# Altium schematic sheet Chain.SchDoc
size A0
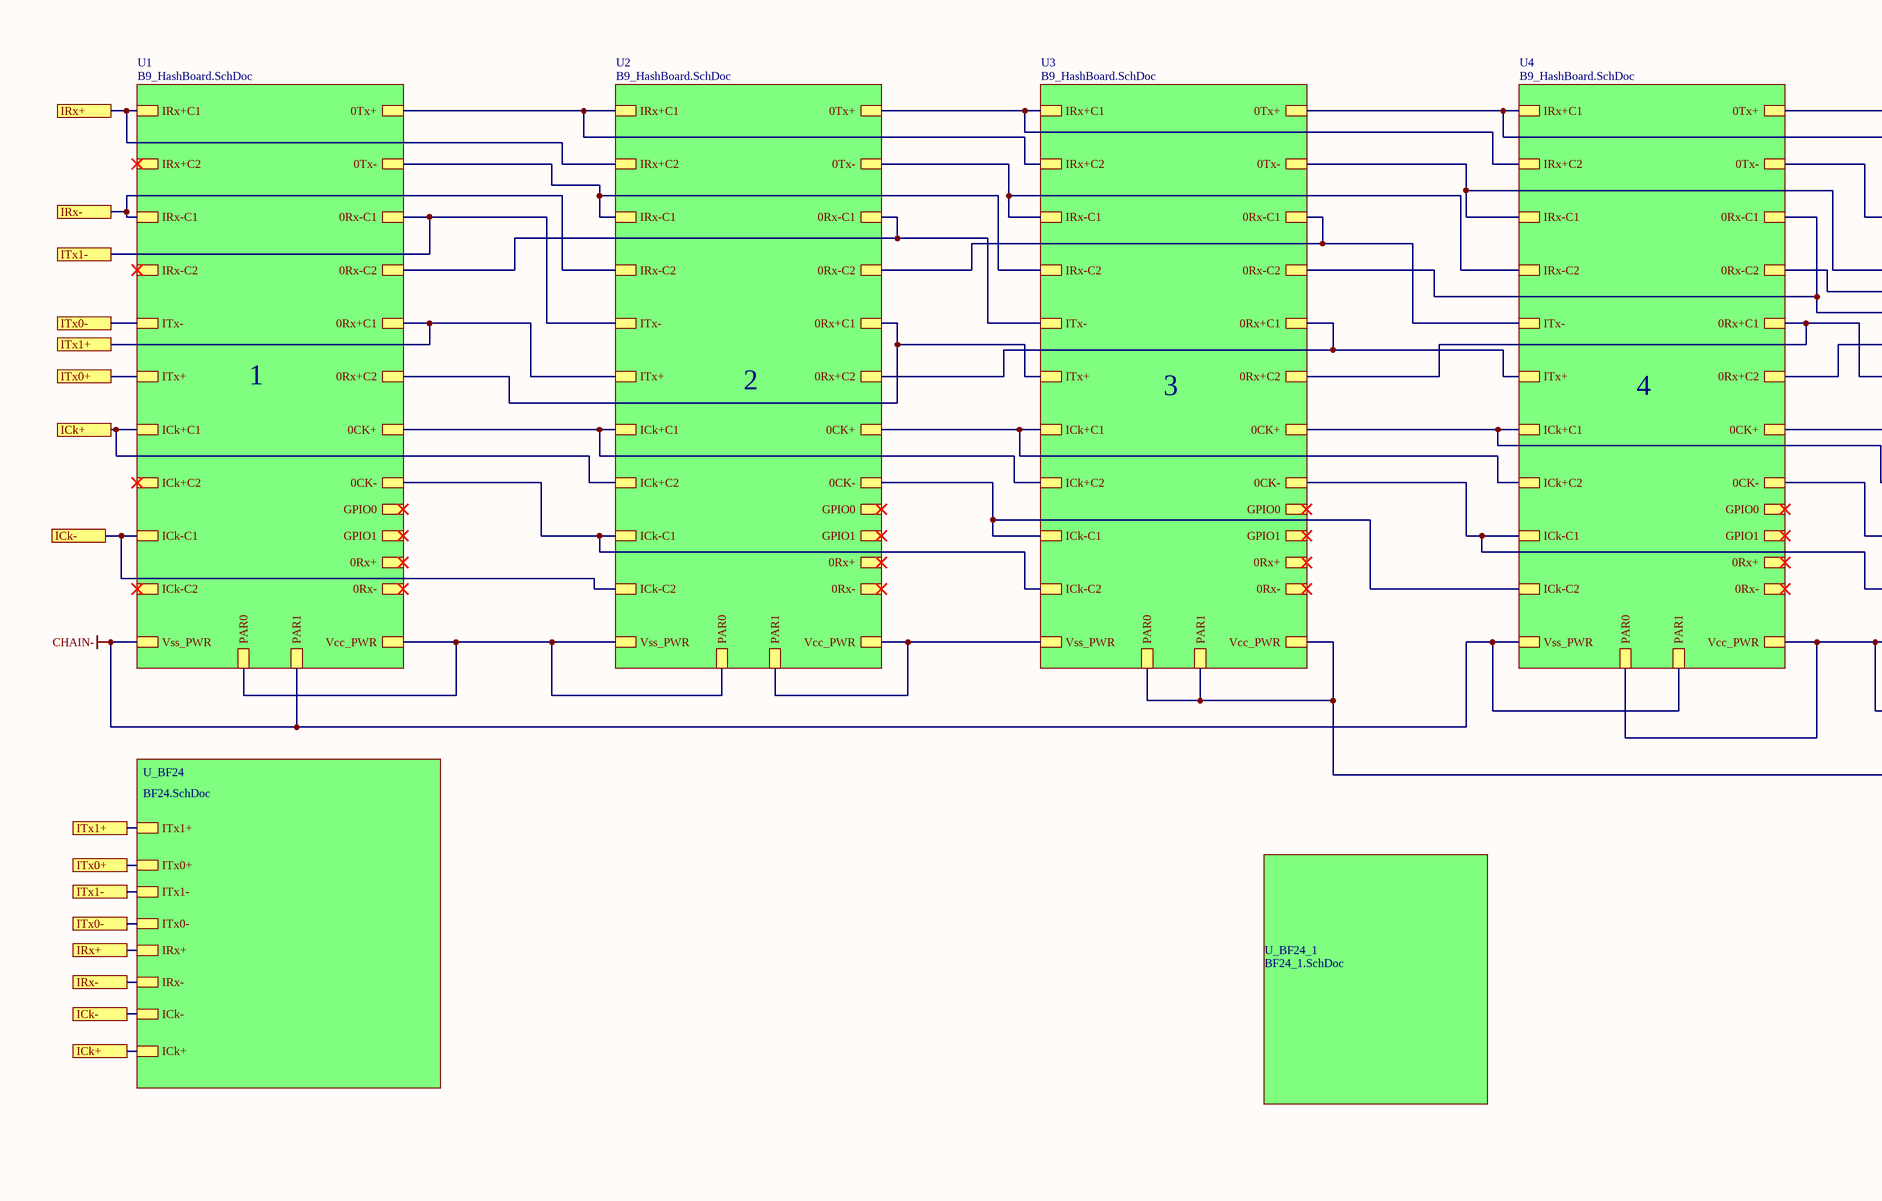
[diagram p0: Chain.SchDoc, top left]
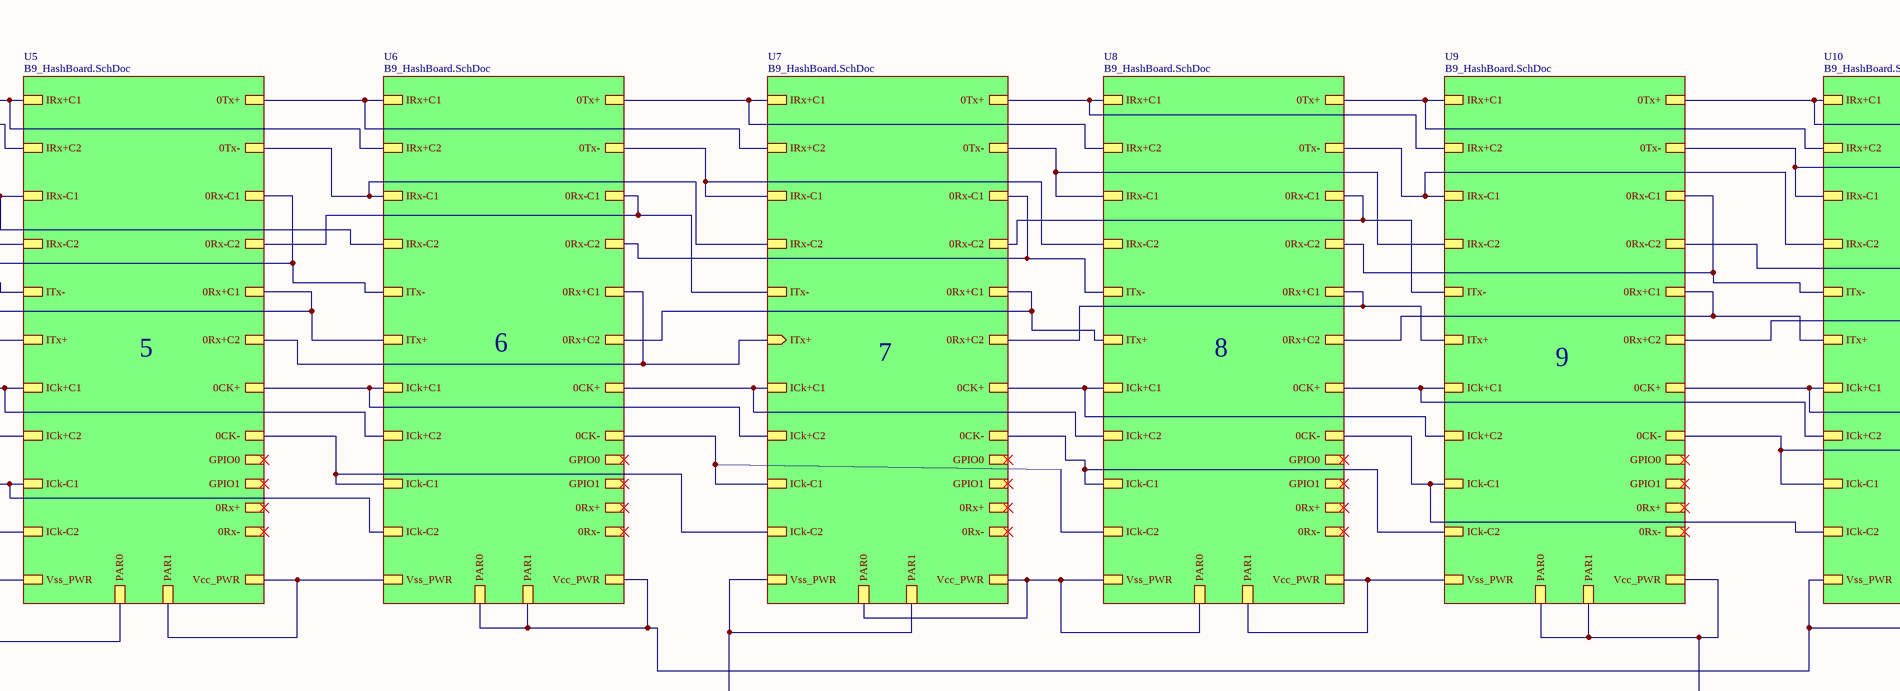
[diagram p1: Chain.SchDoc, top middle]
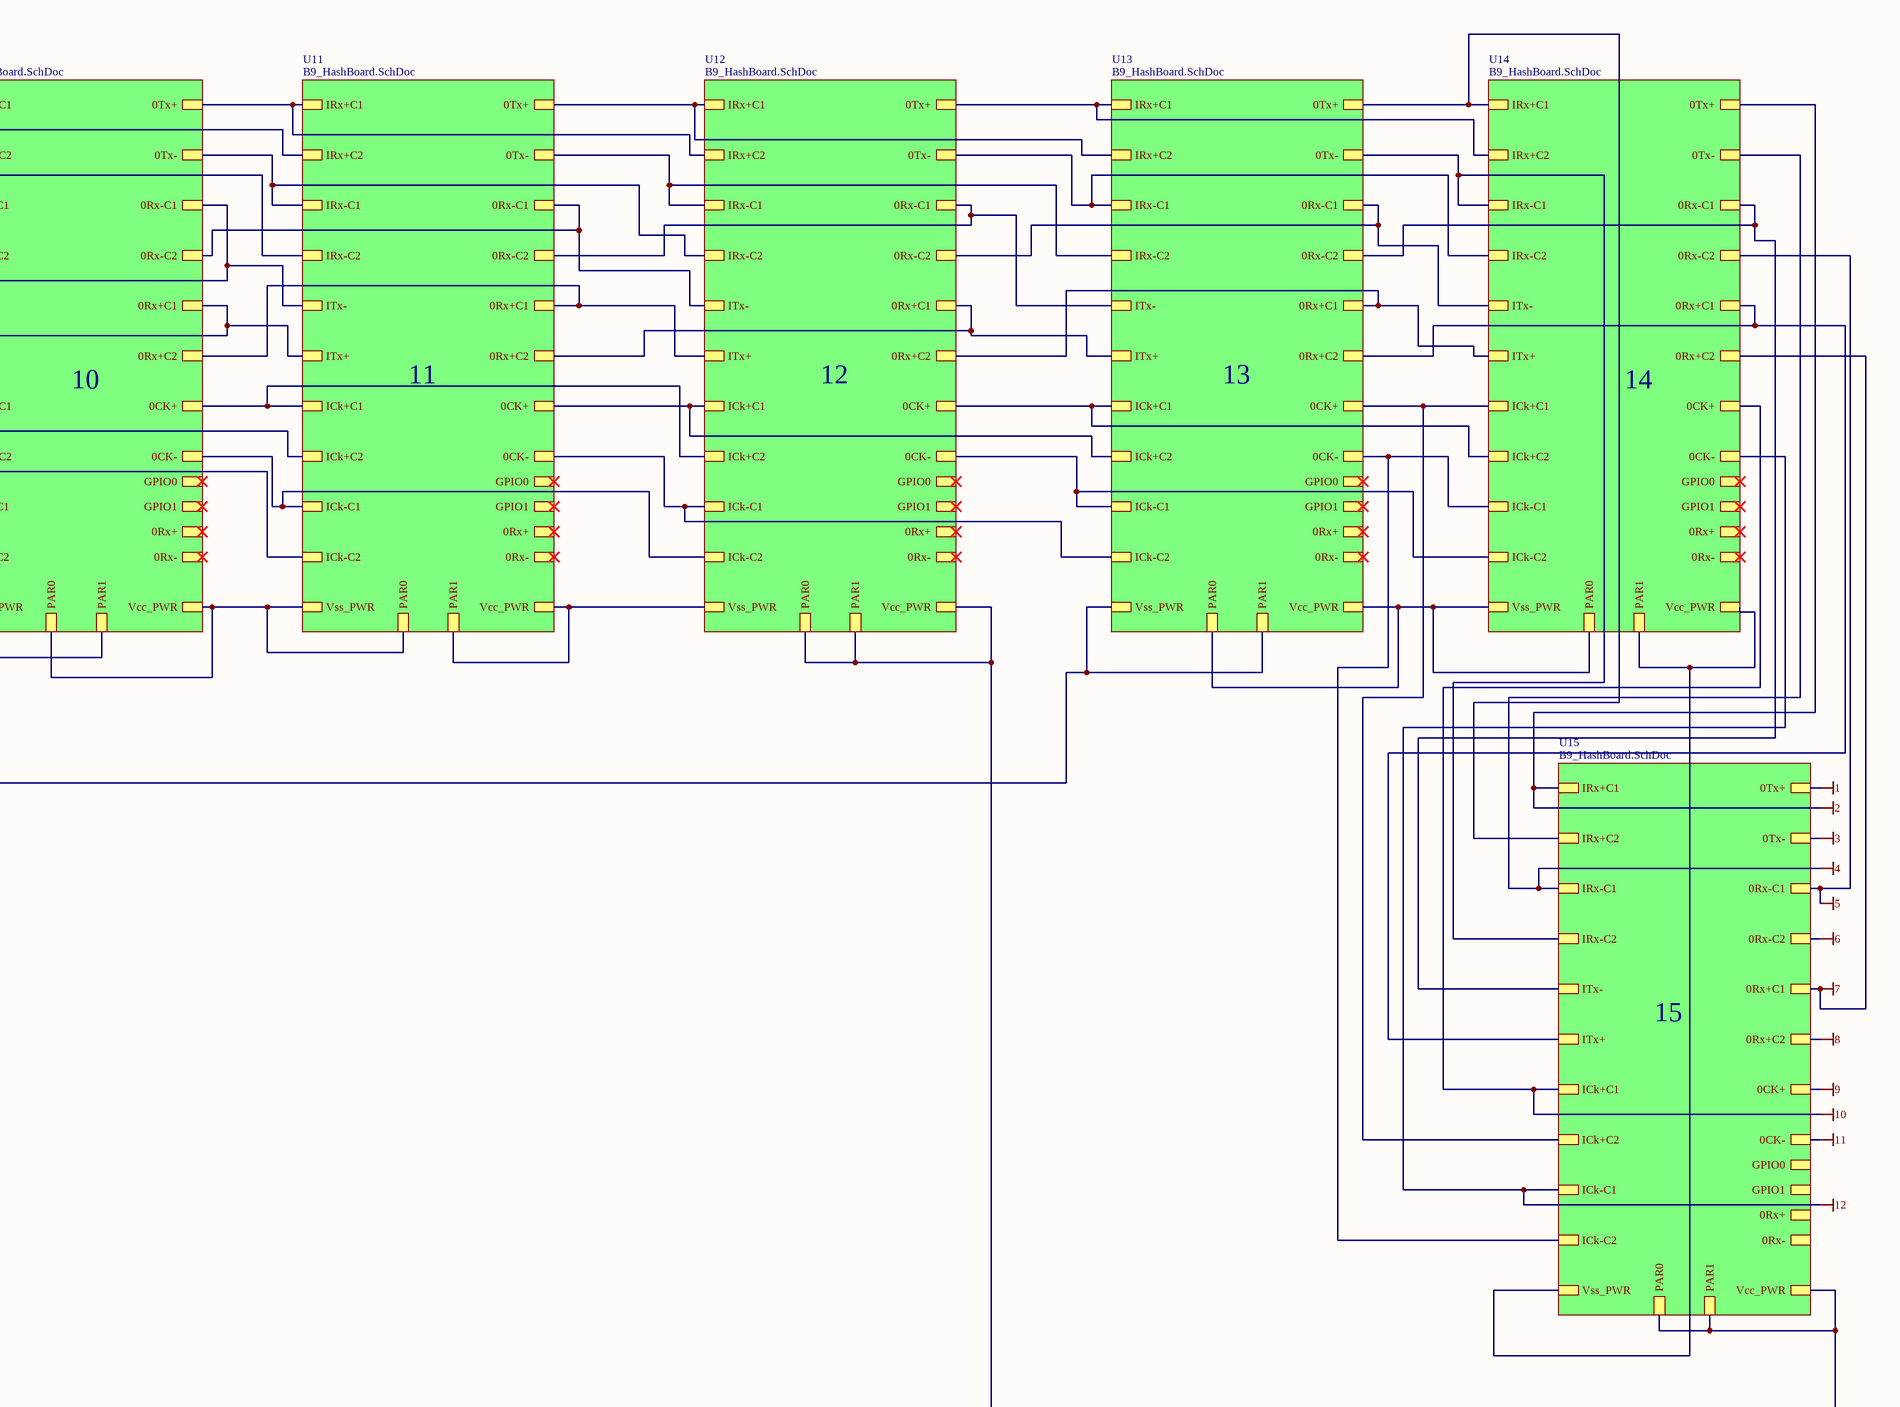
[diagram p2: Chain.SchDoc, top right]
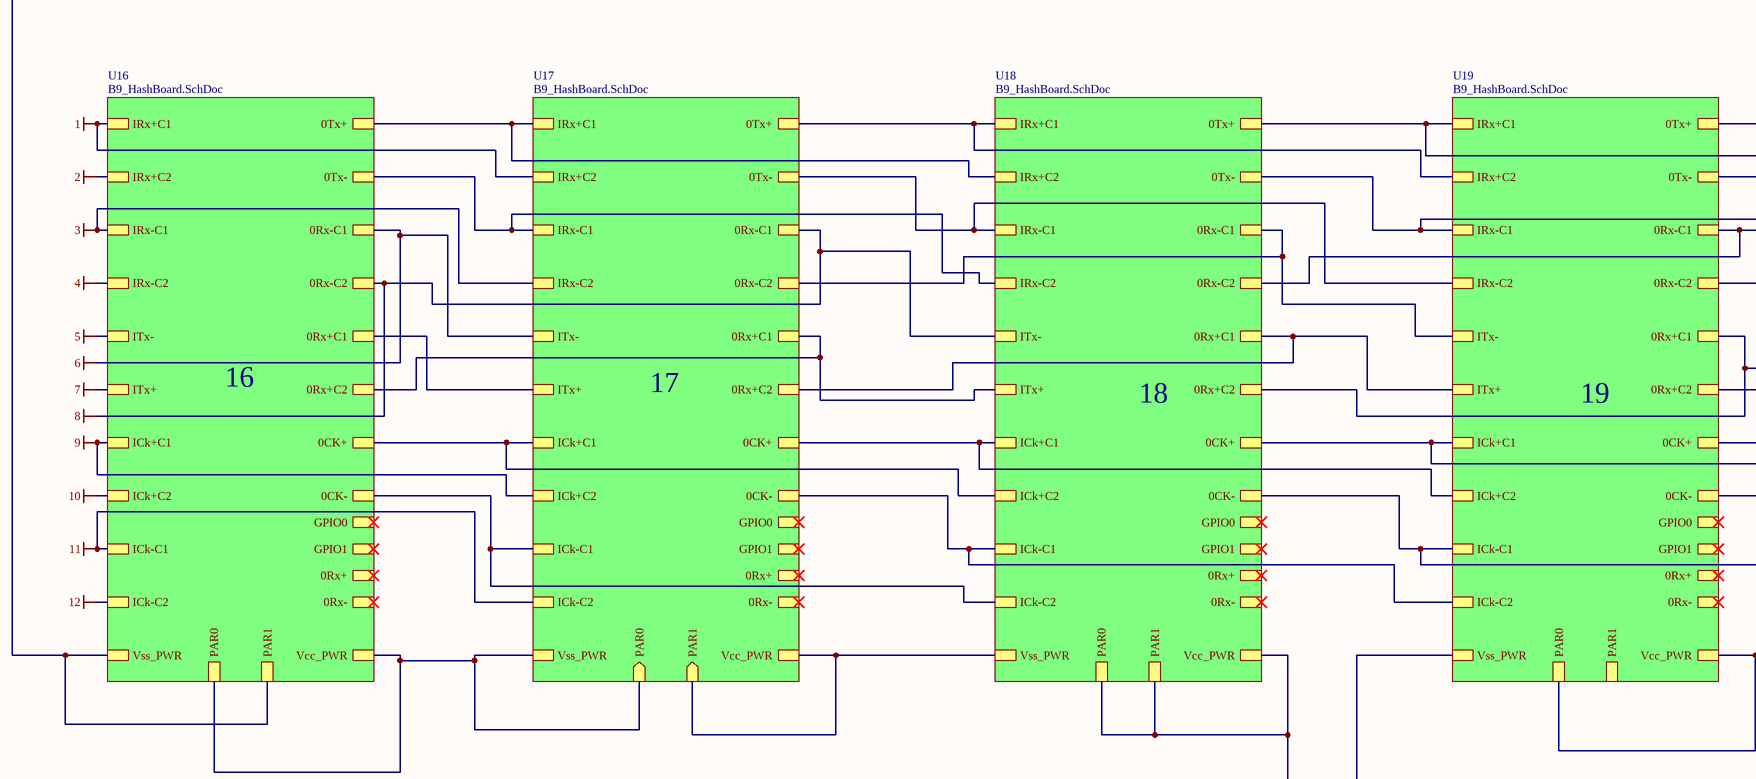
[diagram p3: Chain.SchDoc, bottom left]
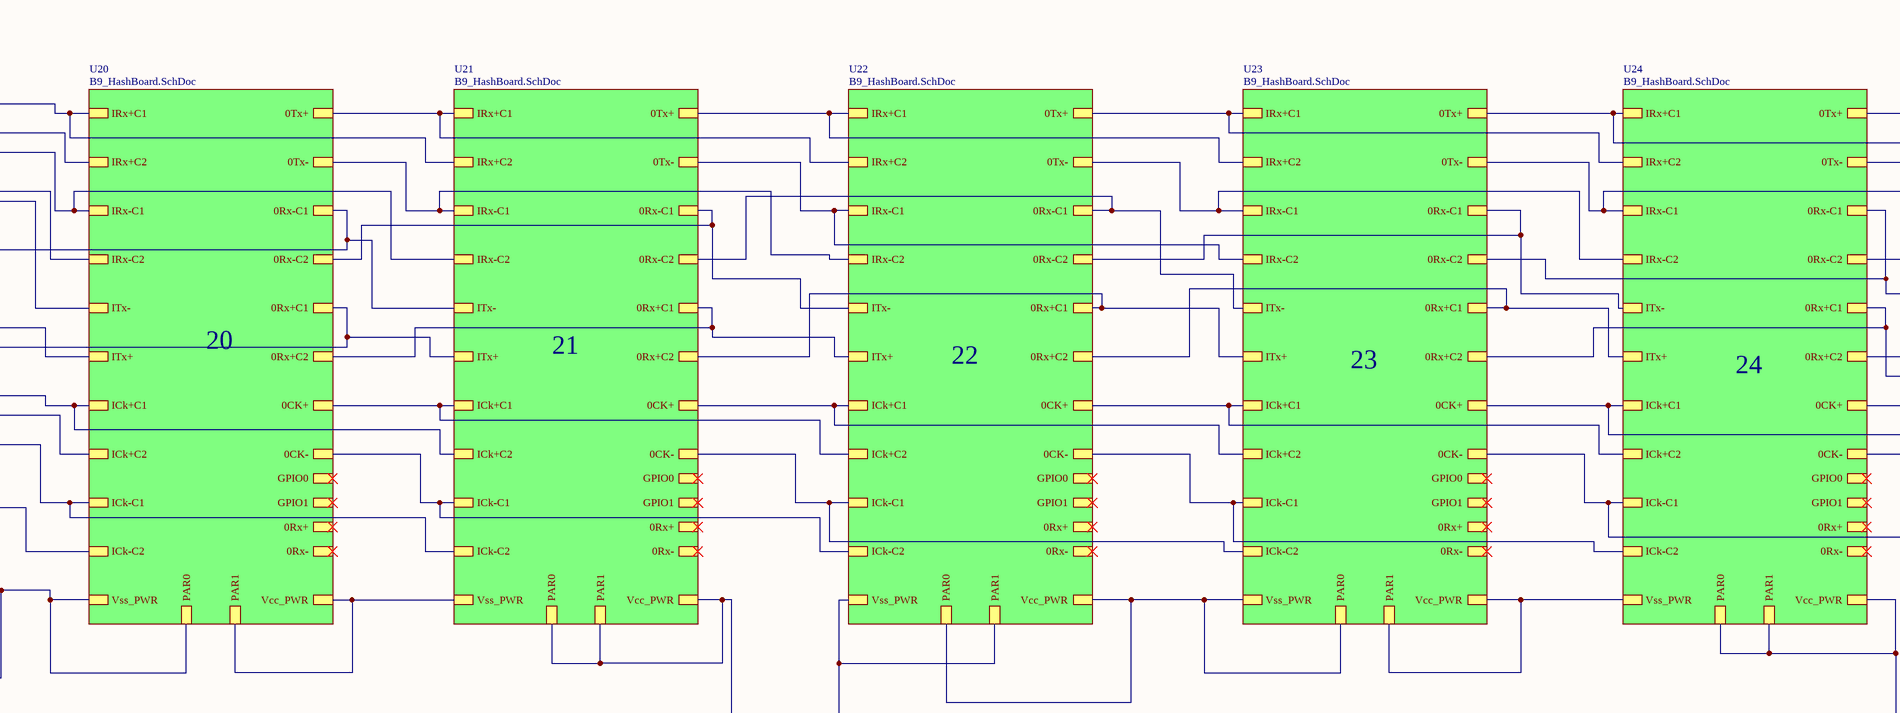
[diagram p4: Chain.SchDoc, bottom middle]
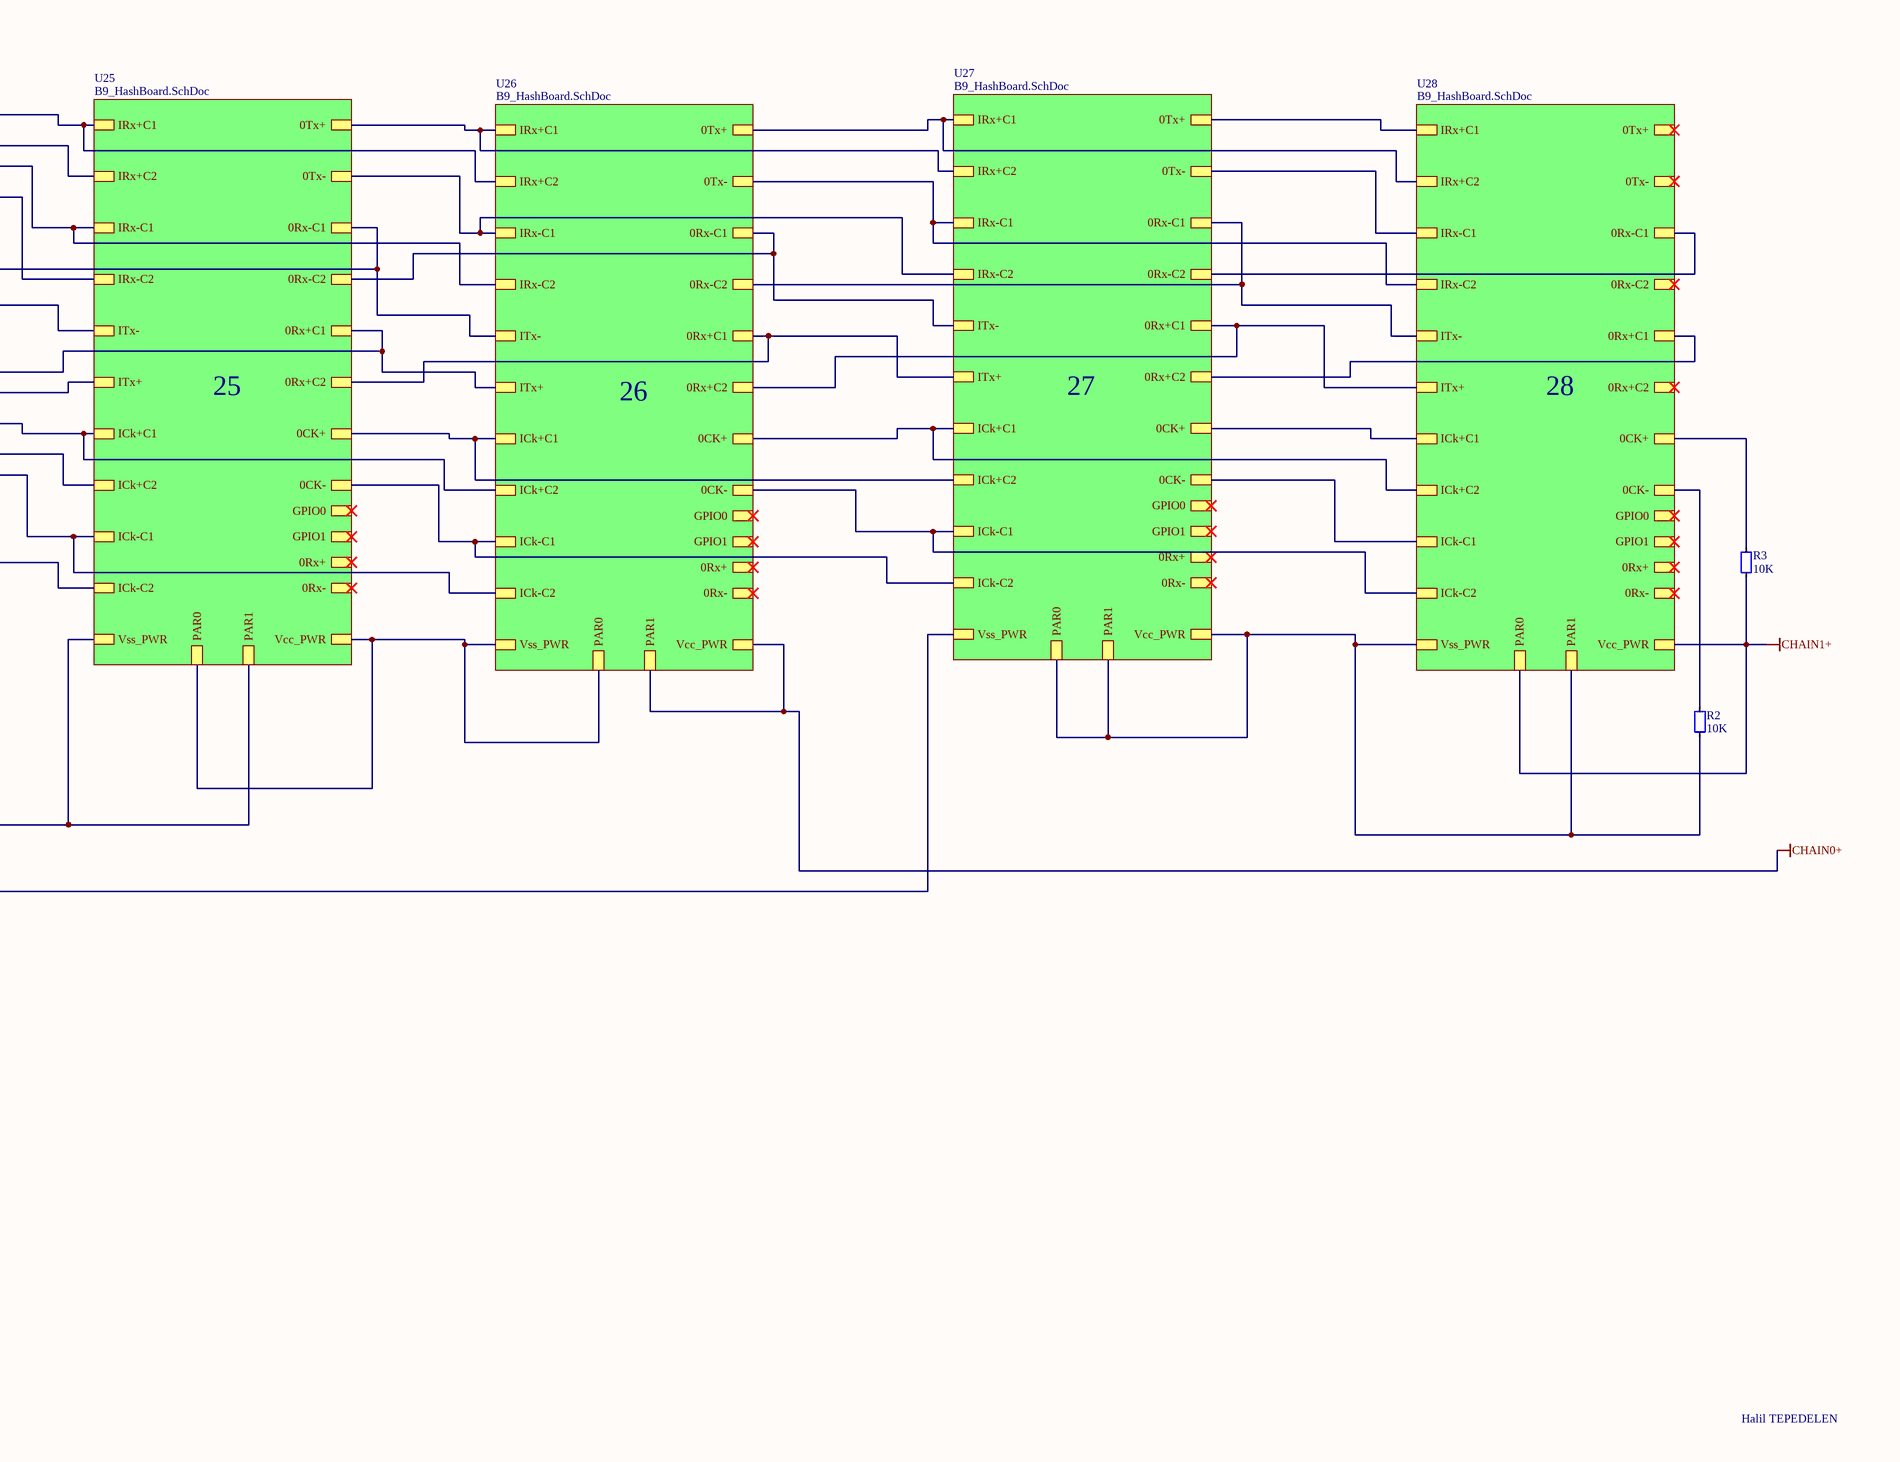
[diagram p5: Chain.SchDoc, bottom right]

## Parts
R2  10K  [R-0402R]
R3  10K  [R-0402R]

## Sub-sheets
U1 = B9_HashBoard.SchDoc: Vcc_PWR, Vss_PWR, 0Rx+, 0Rx-, 0Rx+C1, 0Rx-C1, 0Rx+C2, 0Rx-C2, 0Tx+, 0Tx-, 0CK+, 0CK-, ICk-C1, ICk+C1, IRx-C1, IRx+C1, ITx-, ITx+, IRx-C2, IRx+C2, ICk-C2, ICk+C2, PAR0, PAR1, GPIO0, GPIO1
U2 = B9_HashBoard.SchDoc: Vcc_PWR, Vss_PWR, 0Rx+, 0Rx-, 0Rx+C1, 0Rx-C1, 0Rx+C2, 0Rx-C2, 0Tx+, 0Tx-, 0CK+, 0CK-, ICk-C1, ICk+C1, IRx-C1, IRx+C1, ITx-, ITx+, IRx-C2, IRx+C2, ICk-C2, ICk+C2, PAR0, PAR1, GPIO0, GPIO1
U3 = B9_HashBoard.SchDoc: Vcc_PWR, Vss_PWR, 0Rx+, 0Rx-, 0Rx+C1, 0Rx-C1, 0Rx+C2, 0Rx-C2, 0Tx+, 0Tx-, 0CK+, 0CK-, ICk-C1, ICk+C1, IRx-C1, IRx+C1, ITx-, ITx+, IRx-C2, IRx+C2, ICk-C2, ICk+C2, PAR0, PAR1, GPIO0, GPIO1
U4 = B9_HashBoard.SchDoc: Vcc_PWR, Vss_PWR, 0Rx+, 0Rx-, 0Rx+C1, 0Rx-C1, 0Rx+C2, 0Rx-C2, 0Tx+, 0Tx-, 0CK+, 0CK-, ICk-C1, ICk+C1, IRx-C1, IRx+C1, ITx-, ITx+, IRx-C2, IRx+C2, ICk-C2, ICk+C2, PAR0, PAR1, GPIO0, GPIO1
U5 = B9_HashBoard.SchDoc: Vcc_PWR, Vss_PWR, 0Rx+, 0Rx-, 0Rx+C1, 0Rx-C1, 0Rx+C2, 0Rx-C2, 0Tx+, 0Tx-, 0CK+, 0CK-, ICk-C1, ICk+C1, IRx-C1, IRx+C1, ITx-, ITx+, IRx-C2, IRx+C2, ICk-C2, ICk+C2, PAR0, PAR1, GPIO0, GPIO1
U6 = B9_HashBoard.SchDoc: Vcc_PWR, Vss_PWR, 0Rx+, 0Rx-, 0Rx+C1, 0Rx-C1, 0Rx+C2, 0Rx-C2, 0Tx+, 0Tx-, 0CK+, 0CK-, ICk-C1, ICk+C1, IRx-C1, IRx+C1, ITx-, ITx+, IRx-C2, IRx+C2, ICk-C2, ICk+C2, PAR0, PAR1, GPIO0, GPIO1
U7 = B9_HashBoard.SchDoc: Vcc_PWR, Vss_PWR, 0Rx+, 0Rx-, 0Rx+C1, 0Rx-C1, 0Rx+C2, 0Rx-C2, 0Tx+, 0Tx-, 0CK+, 0CK-, ICk-C1, ICk+C1, IRx-C1, IRx+C1, ITx-, ITx+ (in), IRx-C2, IRx+C2, ICk-C2, ICk+C2, PAR0, PAR1, GPIO0, GPIO1
U8 = B9_HashBoard.SchDoc: Vcc_PWR, Vss_PWR, 0Rx+, 0Rx-, 0Rx+C1, 0Rx-C1, 0Rx+C2, 0Rx-C2, 0Tx+, 0Tx-, 0CK+, 0CK-, ICk-C1, ICk+C1, IRx-C1, IRx+C1, ITx-, ITx+, IRx-C2, IRx+C2, ICk-C2, ICk+C2, PAR0, PAR1, GPIO0, GPIO1
U9 = B9_HashBoard.SchDoc: Vcc_PWR, Vss_PWR, 0Rx+, 0Rx-, 0Rx+C1, 0Rx-C1, 0Rx+C2, 0Rx-C2, 0Tx+, 0Tx-, 0CK+, 0CK-, ICk-C1, ICk+C1, IRx-C1, IRx+C1, ITx-, ITx+, IRx-C2, IRx+C2, ICk-C2, ICk+C2, PAR0, PAR1, GPIO0, GPIO1
U10 = B9_HashBoard.SchDoc: Vcc_PWR, Vss_PWR, 0Rx+, 0Rx-, 0Rx+C1, 0Rx-C1, 0Rx+C2, 0Rx-C2, 0Tx+, 0Tx-, 0CK+, 0CK-, ICk-C1, ICk+C1, IRx-C1, IRx+C1, ITx-, ITx+, IRx-C2, IRx+C2, ICk-C2, ICk+C2, PAR0, PAR1, GPIO0, GPIO1
U11 = B9_HashBoard.SchDoc: Vcc_PWR, Vss_PWR, 0Rx+, 0Rx-, 0Rx+C1, 0Rx-C1, 0Rx+C2, 0Rx-C2, 0Tx+, 0Tx-, 0CK+, 0CK-, ICk-C1, ICk+C1, IRx-C1, IRx+C1, ITx-, ITx+, IRx-C2, IRx+C2, ICk-C2, ICk+C2, PAR0, PAR1, GPIO0, GPIO1
U12 = B9_HashBoard.SchDoc: Vcc_PWR, Vss_PWR, 0Rx+, 0Rx-, 0Rx+C1, 0Rx-C1, 0Rx+C2, 0Rx-C2, 0Tx+, 0Tx-, 0CK+, 0CK-, ICk-C1, ICk+C1, IRx-C1, IRx+C1, ITx-, ITx+, IRx-C2, IRx+C2, ICk-C2, ICk+C2, PAR0, PAR1, GPIO0, GPIO1
U13 = B9_HashBoard.SchDoc: Vcc_PWR, Vss_PWR, 0Rx+, 0Rx-, 0Rx+C1, 0Rx-C1, 0Rx+C2, 0Rx-C2, 0Tx+, 0Tx-, 0CK+, 0CK-, ICk-C1, ICk+C1, IRx-C1, IRx+C1, ITx-, ITx+, IRx-C2, IRx+C2, ICk-C2, ICk+C2, PAR0, PAR1, GPIO0, GPIO1
U14 = B9_HashBoard.SchDoc: Vcc_PWR, Vss_PWR, 0Rx+, 0Rx-, 0Rx+C1, 0Rx-C1, 0Rx+C2, 0Rx-C2, 0Tx+, 0Tx-, 0CK+, 0CK-, ICk-C1, ICk+C1, IRx-C1, IRx+C1, ITx-, ITx+, IRx-C2, IRx+C2, ICk-C2, ICk+C2, PAR0, PAR1, GPIO0, GPIO1
U15 = B9_HashBoard.SchDoc: Vcc_PWR, Vss_PWR, 0Rx+, 0Rx-, 0Rx+C1, 0Rx-C1, 0Rx+C2, 0Rx-C2, 0Tx+, 0Tx-, 0CK+, 0CK-, ICk-C1, ICk+C1, IRx-C1, IRx+C1, ITx-, ITx+, IRx-C2, IRx+C2, ICk-C2, ICk+C2, PAR0, PAR1, GPIO0, GPIO1
U16 = B9_HashBoard.SchDoc: Vcc_PWR, Vss_PWR, 0Rx+, 0Rx-, 0Rx+C1, 0Rx-C1, 0Rx+C2, 0Rx-C2, 0Tx+, 0Tx-, 0CK+, 0CK-, ICk-C1, ICk+C1, IRx-C1, IRx+C1, ITx-, ITx+, IRx-C2, IRx+C2, ICk-C2, ICk+C2, PAR0, PAR1, GPIO0, GPIO1
U17 = B9_HashBoard.SchDoc: Vcc_PWR, Vss_PWR, 0Rx+, 0Rx-, 0Rx+C1, 0Rx-C1, 0Rx+C2, 0Rx-C2, 0Tx+, 0Tx-, 0CK+, 0CK-, ICk-C1, ICk+C1, IRx-C1, IRx+C1, ITx-, ITx+, IRx-C2, IRx+C2, ICk-C2, ICk+C2, PAR0 (in), PAR1 (in), GPIO0, GPIO1
U18 = B9_HashBoard.SchDoc: Vcc_PWR, Vss_PWR, 0Rx+, 0Rx-, 0Rx+C1, 0Rx-C1, 0Rx+C2, 0Rx-C2, 0Tx+, 0Tx-, 0CK+, 0CK-, ICk-C1, ICk+C1, IRx-C1, IRx+C1, ITx-, ITx+, IRx-C2, IRx+C2, ICk-C2, ICk+C2, PAR0, PAR1, GPIO0, GPIO1
U19 = B9_HashBoard.SchDoc: Vcc_PWR, Vss_PWR, 0Rx+, 0Rx-, 0Rx+C1, 0Rx-C1, 0Rx+C2, 0Rx-C2, 0Tx+, 0Tx-, 0CK+, 0CK-, ICk-C1, ICk+C1, IRx-C1, IRx+C1, ITx-, ITx+, IRx-C2, IRx+C2, ICk-C2, ICk+C2, PAR0, PAR1, GPIO0, GPIO1
U20 = B9_HashBoard.SchDoc: Vcc_PWR, Vss_PWR, 0Rx+, 0Rx-, 0Rx+C1, 0Rx-C1, 0Rx+C2, 0Rx-C2, 0Tx+, 0Tx-, 0CK+, 0CK-, ICk-C1, ICk+C1, IRx-C1, IRx+C1, ITx-, ITx+, IRx-C2, IRx+C2, ICk-C2, ICk+C2, PAR0, PAR1, GPIO0, GPIO1
U21 = B9_HashBoard.SchDoc: Vcc_PWR, Vss_PWR, 0Rx+, 0Rx-, 0Rx+C1, 0Rx-C1, 0Rx+C2, 0Rx-C2, 0Tx+, 0Tx-, 0CK+, 0CK-, ICk-C1, ICk+C1, IRx-C1, IRx+C1, ITx-, ITx+, IRx-C2, IRx+C2, ICk-C2, ICk+C2, PAR0, PAR1, GPIO0, GPIO1
U22 = B9_HashBoard.SchDoc: Vcc_PWR, Vss_PWR, 0Rx+, 0Rx-, 0Rx+C1, 0Rx-C1, 0Rx+C2, 0Rx-C2, 0Tx+, 0Tx-, 0CK+, 0CK-, ICk-C1, ICk+C1, IRx-C1, IRx+C1, ITx-, ITx+, IRx-C2, IRx+C2, ICk-C2, ICk+C2, PAR0, PAR1, GPIO0, GPIO1
U23 = B9_HashBoard.SchDoc: Vcc_PWR, Vss_PWR, 0Rx+, 0Rx-, 0Rx+C1, 0Rx-C1, 0Rx+C2, 0Rx-C2, 0Tx+, 0Tx-, 0CK+, 0CK-, ICk-C1, ICk+C1, IRx-C1, IRx+C1, ITx-, ITx+, IRx-C2, IRx+C2, ICk-C2, ICk+C2, PAR0, PAR1, GPIO0, GPIO1
U24 = B9_HashBoard.SchDoc: Vcc_PWR, Vss_PWR, 0Rx+, 0Rx-, 0Rx+C1, 0Rx-C1, 0Rx+C2, 0Rx-C2, 0Tx+, 0Tx-, 0CK+, 0CK-, ICk-C1, ICk+C1, IRx-C1, IRx+C1, ITx-, ITx+, IRx-C2, IRx+C2, ICk-C2, ICk+C2, PAR0, PAR1, GPIO0, GPIO1
U25 = B9_HashBoard.SchDoc: Vcc_PWR, Vss_PWR, 0Rx+, 0Rx-, 0Rx+C1, 0Rx-C1, 0Rx+C2, 0Rx-C2, 0Tx+, 0Tx-, 0CK+, 0CK-, ICk-C1, ICk+C1, IRx-C1, IRx+C1, ITx-, ITx+, IRx-C2, IRx+C2, ICk-C2, ICk+C2, PAR0, PAR1, GPIO0, GPIO1
U26 = B9_HashBoard.SchDoc: Vcc_PWR, Vss_PWR, 0Rx+, 0Rx-, 0Rx+C1, 0Rx-C1, 0Rx+C2, 0Rx-C2, 0Tx+, 0Tx-, 0CK+, 0CK-, ICk-C1, ICk+C1, IRx-C1, IRx+C1, ITx-, ITx+, IRx-C2, IRx+C2, ICk-C2, ICk+C2, PAR0, PAR1, GPIO0, GPIO1
U27 = B9_HashBoard.SchDoc: Vcc_PWR, Vss_PWR, 0Rx+, 0Rx-, 0Rx+C1, 0Rx-C1, 0Rx+C2, 0Rx-C2, 0Tx+, 0Tx-, 0CK+, 0CK-, ICk-C1, ICk+C1, IRx-C1, IRx+C1, ITx-, ITx+, IRx-C2, IRx+C2, ICk-C2, ICk+C2, PAR0, PAR1, GPIO0, GPIO1
U28 = B9_HashBoard.SchDoc: Vcc_PWR, Vss_PWR, 0Rx+, 0Rx-, 0Rx+C1, 0Rx-C1, 0Rx+C2, 0Rx-C2, 0Tx+, 0Tx-, 0CK+, 0CK-, ICk-C1, ICk+C1, IRx-C1, IRx+C1, ITx-, ITx+, IRx-C2, IRx+C2, ICk-C2, ICk+C2, PAR0, PAR1, GPIO0, GPIO1
U_BF24 = BF24.SchDoc: ITx1+, ITx0+, ITx1-, ITx0-, IRx+, IRx-, ICk-, ICk+
U_BF24_1 = BF24_1.SchDoc: no entries

## Ports
ICk+, ICk-, IRx+, IRx-, ITx0+, ITx0-, ITx1+, ITx1-

## Nets
1: sheet U15/0Tx+, sheet U16/IRx+C1, sheet U17/IRx+C2
2: sheet U14/0Tx+, sheet U15/IRx+C1, sheet U16/IRx+C2
3: sheet U15/0Tx-, sheet U16/IRx-C1, sheet U17/IRx-C2
4: sheet U14/0Tx-, sheet U15/IRx-C1, sheet U16/IRx-C2
5: sheet U14/0Rx-C2, sheet U15/0Rx-C1, sheet U16/ITx-
6: sheet U15/0Rx-C2, sheet U16/0Rx-C1, sheet U17/ITx-
7: sheet U14/0Rx+C2, sheet U15/0Rx+C1, sheet U16/ITx+
8: sheet U15/0Rx+C2, sheet U16/0Rx-C2, sheet U17/0Rx-C1, sheet U18/ITx-
9: sheet U15/0CK+, sheet U16/ICk+C1, sheet U17/ICk+C2
10: sheet U14/0CK+, sheet U15/ICk+C1, sheet U16/ICk+C2
11: sheet U15/0CK-, sheet U16/ICk-C1, sheet U17/ICk-C2
12: sheet U14/0CK-, sheet U15/ICk-C1, sheet U16/ICk-C2
CHAIN0+: sheet U26/Vcc_PWR, sheet U26/PAR1
CHAIN1+: R3.1 ; sheet U28/Vcc_PWR, sheet U28/PAR0
CHAIN-: sheet U1/Vss_PWR, sheet U1/PAR1, sheet U4/Vss_PWR, sheet U4/PAR1
ICk+: port ICk+, sheet U1/ICk+C1, sheet U2/ICk+C2, sheet U_BF24/ICk+
ICk-: port ICk-, sheet U1/ICk-C1, sheet U2/ICk-C2, sheet U_BF24/ICk-
IRx+: port IRx+, sheet U1/IRx+C1, sheet U2/IRx+C2, sheet U_BF24/IRx+
IRx-: port IRx-, sheet U1/IRx-C1, sheet U2/IRx-C2, sheet U_BF24/IRx-
ITx0+: port ITx0+, sheet U1/ITx+, sheet U_BF24/ITx0+
ITx0-: port ITx0-, sheet U1/ITx-, sheet U_BF24/ITx0-
ITx1+: port ITx1+, sheet U1/0Rx+C1, sheet U2/ITx+, sheet U_BF24/ITx1+
ITx1-: port ITx1-, sheet U1/0Rx-C1, sheet U2/ITx-, sheet U_BF24/ITx1-
NetR2_1: R2.1 ; sheet U27/Vcc_PWR, sheet U27/PAR0, sheet U27/PAR1, sheet U28/Vss_PWR, sheet U28/PAR1
NetR2_2: R2.2 ; sheet U28/0CK-
NetR3_2: R3.2 ; sheet U28/0CK+
(unnamed): sheet U1/Vcc_PWR, sheet U1/PAR0, sheet U2/Vss_PWR, sheet U2/PAR0
(unnamed): sheet U1/0Rx+C2, sheet U2/0Rx+C1, sheet U3/ITx+
(unnamed): sheet U1/0Rx-C2, sheet U2/0Rx-C1, sheet U3/ITx-
(unnamed): sheet U1/0Tx+, sheet U2/IRx+C1, sheet U3/IRx+C2
(unnamed): sheet U1/0Tx-, sheet U2/IRx-C1, sheet U3/IRx-C2
(unnamed): sheet U1/0CK+, sheet U2/ICk+C1, sheet U3/ICk+C2
(unnamed): sheet U1/0CK-, sheet U2/ICk-C1, sheet U3/ICk-C2
(unnamed): sheet U2/Vcc_PWR, sheet U2/PAR1, sheet U3/Vss_PWR
(unnamed): sheet U2/0Rx+C2, sheet U3/0Rx+C1, sheet U4/ITx+
(unnamed): sheet U2/0Rx-C2, sheet U3/0Rx-C1, sheet U4/ITx-
(unnamed): sheet U2/0Tx+, sheet U3/IRx+C1, sheet U4/IRx+C2
(unnamed): sheet U2/0Tx-, sheet U3/IRx-C1, sheet U4/IRx-C2
(unnamed): sheet U2/0CK+, sheet U3/ICk+C1, sheet U4/ICk+C2
(unnamed): sheet U2/0CK-, sheet U3/ICk-C1, sheet U4/ICk-C2
(unnamed): sheet U3/Vcc_PWR, sheet U3/PAR0, sheet U3/PAR1, sheet U7/Vss_PWR, sheet U7/PAR1
(unnamed): sheet U3/0Rx+C2, sheet U4/0Rx+C1, sheet U5/ITx+
(unnamed): sheet U3/0Rx-C2, sheet U4/0Rx-C1, sheet U5/ITx-
(unnamed): sheet U3/0Tx+, sheet U4/IRx+C1, sheet U5/IRx+C2
(unnamed): sheet U3/0Tx-, sheet U4/IRx-C1, sheet U5/IRx-C2
(unnamed): sheet U3/0CK+, sheet U4/ICk+C1, sheet U5/ICk+C2
(unnamed): sheet U3/0CK-, sheet U4/ICk-C1, sheet U5/ICk-C2
(unnamed): sheet U4/Vcc_PWR, sheet U4/PAR0, sheet U5/Vss_PWR, sheet U5/PAR0
(unnamed): sheet U4/0Rx+C2, sheet U5/0Rx+C1, sheet U6/ITx+
(unnamed): sheet U4/0Rx-C2, sheet U5/0Rx-C1, sheet U6/ITx-
(unnamed): sheet U4/0Tx+, sheet U5/IRx+C1, sheet U6/IRx+C2
(unnamed): sheet U4/0Tx-, sheet U5/IRx-C1, sheet U6/IRx-C2
(unnamed): sheet U4/0CK+, sheet U5/ICk+C1, sheet U6/ICk+C2
(unnamed): sheet U4/0CK-, sheet U5/ICk-C1, sheet U6/ICk-C2
(unnamed): sheet U5/Vcc_PWR, sheet U5/PAR1, sheet U6/Vss_PWR
(unnamed): sheet U5/0Rx+C2, sheet U6/0Rx+C1, sheet U7/ITx+
(unnamed): sheet U5/0Rx-C2, sheet U6/0Rx-C1, sheet U7/ITx-
(unnamed): sheet U5/0Tx+, sheet U6/IRx+C1, sheet U7/IRx+C2
(unnamed): sheet U5/0Tx-, sheet U6/IRx-C1, sheet U7/IRx-C2
(unnamed): sheet U5/0CK+, sheet U6/ICk+C1, sheet U7/ICk+C2
(unnamed): sheet U5/0CK-, sheet U6/ICk-C1, sheet U7/ICk-C2
(unnamed): sheet U6/Vcc_PWR, sheet U6/PAR0, sheet U6/PAR1, sheet U10/Vss_PWR, sheet U10/PAR1
(unnamed): sheet U6/0Rx+C2, sheet U7/0Rx+C1, sheet U8/ITx+
(unnamed): sheet U6/0Rx-C2, sheet U7/0Rx-C1, sheet U8/ITx-
(unnamed): sheet U6/0Tx+, sheet U7/IRx+C1, sheet U8/IRx+C2
(unnamed): sheet U6/0Tx-, sheet U7/IRx-C1, sheet U8/IRx-C2
(unnamed): sheet U6/0CK+, sheet U7/ICk+C1, sheet U8/ICk+C2
(unnamed): sheet U6/0CK-, sheet U7/ICk-C1, sheet U8/ICk-C2
(unnamed): sheet U7/Vcc_PWR, sheet U7/PAR0, sheet U8/Vss_PWR, sheet U8/PAR0
(unnamed): sheet U7/0Rx+C2, sheet U8/0Rx+C1, sheet U9/ITx+
(unnamed): sheet U7/0Rx-C2, sheet U8/0Rx-C1, sheet U9/ITx-
(unnamed): sheet U7/0Tx+, sheet U8/IRx+C1, sheet U9/IRx+C2
(unnamed): sheet U7/0Tx-, sheet U8/IRx-C1, sheet U9/IRx-C2
(unnamed): sheet U7/0CK+, sheet U8/ICk+C1, sheet U9/ICk+C2
(unnamed): sheet U7/0CK-, sheet U8/ICk-C1, sheet U9/ICk-C2
(unnamed): sheet U8/Vcc_PWR, sheet U8/PAR1, sheet U9/Vss_PWR
(unnamed): sheet U8/0Rx+C2, sheet U9/0Rx+C1, sheet U10/ITx+
(unnamed): sheet U8/0Rx-C2, sheet U9/0Rx-C1, sheet U10/ITx-
(unnamed): sheet U8/0Tx+, sheet U9/IRx+C1, sheet U10/IRx+C2
(unnamed): sheet U8/0Tx-, sheet U9/IRx-C1, sheet U10/IRx-C2
(unnamed): sheet U8/0CK+, sheet U9/ICk+C1, sheet U10/ICk+C2
(unnamed): sheet U8/0CK-, sheet U9/ICk-C1, sheet U10/ICk-C2
(unnamed): sheet U9/Vcc_PWR, sheet U9/PAR0, sheet U9/PAR1, sheet U13/Vss_PWR, sheet U13/PAR1
(unnamed): sheet U9/0Rx+C2, sheet U10/0Rx+C1, sheet U11/ITx+
(unnamed): sheet U9/0Rx-C2, sheet U10/0Rx-C1, sheet U11/ITx-
(unnamed): sheet U9/0Tx+, sheet U10/IRx+C1, sheet U11/IRx+C2
(unnamed): sheet U9/0Tx-, sheet U10/IRx-C1, sheet U11/IRx-C2
(unnamed): sheet U9/0CK+, sheet U10/ICk+C1, sheet U11/ICk+C2
(unnamed): sheet U9/0CK-, sheet U10/ICk-C1, sheet U11/ICk-C2
(unnamed): sheet U10/Vcc_PWR, sheet U10/PAR0, sheet U11/Vss_PWR, sheet U11/PAR0
(unnamed): sheet U10/0Rx+C2, sheet U11/0Rx+C1, sheet U12/ITx+
(unnamed): sheet U10/0Rx-C2, sheet U11/0Rx-C1, sheet U12/ITx-
(unnamed): sheet U10/0Tx+, sheet U11/IRx+C1, sheet U12/IRx+C2
(unnamed): sheet U10/0Tx-, sheet U11/IRx-C1, sheet U12/IRx-C2
(unnamed): sheet U10/0CK+, sheet U11/ICk+C1, sheet U12/ICk+C2
(unnamed): sheet U10/0CK-, sheet U11/ICk-C1, sheet U12/ICk-C2
(unnamed): sheet U11/Vcc_PWR, sheet U11/PAR1, sheet U12/Vss_PWR
(unnamed): sheet U11/0Rx+C2, sheet U12/0Rx+C1, sheet U13/ITx+
(unnamed): sheet U11/0Rx-C2, sheet U12/0Rx-C1, sheet U13/ITx-
(unnamed): sheet U11/0Tx+, sheet U12/IRx+C1, sheet U13/IRx+C2
(unnamed): sheet U11/0Tx-, sheet U12/IRx-C1, sheet U13/IRx-C2
(unnamed): sheet U11/0CK+, sheet U12/ICk+C1, sheet U13/ICk+C2
(unnamed): sheet U11/0CK-, sheet U12/ICk-C1, sheet U13/ICk-C2
(unnamed): sheet U12/Vcc_PWR, sheet U12/PAR0, sheet U12/PAR1, sheet U16/Vss_PWR, sheet U16/PAR1
(unnamed): sheet U12/0Rx+C2, sheet U13/0Rx+C1, sheet U14/ITx+
(unnamed): sheet U12/0Rx-C2, sheet U13/0Rx-C1, sheet U14/ITx-
(unnamed): sheet U12/0Tx+, sheet U13/IRx+C1, sheet U14/IRx+C2
(unnamed): sheet U12/0Tx-, sheet U13/IRx-C1, sheet U14/IRx-C2
(unnamed): sheet U12/0CK+, sheet U13/ICk+C1, sheet U14/ICk+C2
(unnamed): sheet U12/0CK-, sheet U13/ICk-C1, sheet U14/ICk-C2
(unnamed): sheet U13/Vcc_PWR, sheet U13/PAR0, sheet U14/Vss_PWR, sheet U14/PAR0
(unnamed): sheet U13/0Rx+C2, sheet U14/0Rx+C1, sheet U15/ITx+
(unnamed): sheet U13/0Rx-C2, sheet U14/0Rx-C1, sheet U15/ITx-
(unnamed): sheet U13/0Tx+, sheet U14/IRx+C1, sheet U15/IRx+C2
(unnamed): sheet U13/0Tx-, sheet U14/IRx-C1, sheet U15/IRx-C2
(unnamed): sheet U13/0CK+, sheet U14/ICk+C1, sheet U15/ICk+C2
(unnamed): sheet U13/0CK-, sheet U14/ICk-C1, sheet U15/ICk-C2
(unnamed): sheet U14/Vcc_PWR, sheet U14/PAR1, sheet U15/Vss_PWR
(unnamed): sheet U15/Vcc_PWR, sheet U15/PAR0, sheet U15/PAR1, sheet U19/Vss_PWR
(unnamed): sheet U16/Vcc_PWR, sheet U16/PAR0, sheet U17/Vss_PWR, sheet U17/PAR0
(unnamed): sheet U16/0Rx+C1, sheet U17/ITx+
(unnamed): sheet U16/0Rx+C2, sheet U17/0Rx+C1, sheet U18/ITx+
(unnamed): sheet U16/0Tx+, sheet U17/IRx+C1, sheet U18/IRx+C2
(unnamed): sheet U16/0Tx-, sheet U17/IRx-C1, sheet U18/IRx-C2
(unnamed): sheet U16/0CK+, sheet U17/ICk+C1, sheet U18/ICk+C2
(unnamed): sheet U16/0CK-, sheet U17/ICk-C1, sheet U18/ICk-C2
(unnamed): sheet U17/Vcc_PWR, sheet U17/PAR1, sheet U18/Vss_PWR
(unnamed): sheet U17/0Rx+C2, sheet U18/0Rx+C1, sheet U19/ITx+
(unnamed): sheet U17/0Rx-C2, sheet U18/0Rx-C1, sheet U19/ITx-
(unnamed): sheet U17/0Tx+, sheet U18/IRx+C1, sheet U19/IRx+C2
(unnamed): sheet U17/0Tx-, sheet U18/IRx-C1, sheet U19/IRx-C2
(unnamed): sheet U17/0CK+, sheet U18/ICk+C1, sheet U19/ICk+C2
(unnamed): sheet U17/0CK-, sheet U18/ICk-C1, sheet U19/ICk-C2
(unnamed): sheet U18/Vcc_PWR, sheet U18/PAR0, sheet U18/PAR1, sheet U22/Vss_PWR, sheet U22/PAR1
(unnamed): sheet U18/0Rx+C2, sheet U19/0Rx+C1, sheet U20/ITx+
(unnamed): sheet U18/0Rx-C2, sheet U19/0Rx-C1, sheet U20/ITx-
(unnamed): sheet U18/0Tx+, sheet U19/IRx+C1, sheet U20/IRx+C2
(unnamed): sheet U18/0Tx-, sheet U19/IRx-C1, sheet U20/IRx-C2
(unnamed): sheet U18/0CK+, sheet U19/ICk+C1, sheet U20/ICk+C2
(unnamed): sheet U18/0CK-, sheet U19/ICk-C1, sheet U20/ICk-C2
(unnamed): sheet U19/Vcc_PWR, sheet U19/PAR0, sheet U20/Vss_PWR, sheet U20/PAR0
(unnamed): sheet U19/0Rx+C2, sheet U20/0Rx+C1, sheet U21/ITx+
(unnamed): sheet U19/0Rx-C2, sheet U20/0Rx-C1, sheet U21/ITx-
(unnamed): sheet U19/0Tx+, sheet U20/IRx+C1, sheet U21/IRx+C2
(unnamed): sheet U19/0Tx-, sheet U20/IRx-C1, sheet U21/IRx-C2
(unnamed): sheet U19/0CK+, sheet U20/ICk+C1, sheet U21/ICk+C2
(unnamed): sheet U19/0CK-, sheet U20/ICk-C1, sheet U21/ICk-C2
(unnamed): sheet U20/Vcc_PWR, sheet U20/PAR1, sheet U21/Vss_PWR
(unnamed): sheet U20/0Rx+C2, sheet U21/0Rx+C1, sheet U22/ITx+
(unnamed): sheet U20/0Rx-C2, sheet U21/0Rx-C1, sheet U22/ITx-
(unnamed): sheet U20/0Tx+, sheet U21/IRx+C1, sheet U22/IRx+C2
(unnamed): sheet U20/0Tx-, sheet U21/IRx-C1, sheet U22/IRx-C2
(unnamed): sheet U20/0CK+, sheet U21/ICk+C1, sheet U22/ICk+C2
(unnamed): sheet U20/0CK-, sheet U21/ICk-C1, sheet U22/ICk-C2
(unnamed): sheet U21/Vcc_PWR, sheet U21/PAR0, sheet U21/PAR1, sheet U25/Vss_PWR, sheet U25/PAR1
(unnamed): sheet U21/0Rx+C2, sheet U22/0Rx+C1, sheet U23/ITx+
(unnamed): sheet U21/0Rx-C2, sheet U22/0Rx-C1, sheet U23/ITx-
(unnamed): sheet U21/0Tx+, sheet U22/IRx+C1, sheet U23/IRx+C2
(unnamed): sheet U21/0Tx-, sheet U22/IRx-C1, sheet U23/IRx-C2
(unnamed): sheet U21/0CK+, sheet U22/ICk+C1, sheet U23/ICk+C2
(unnamed): sheet U21/0CK-, sheet U22/ICk-C1, sheet U23/ICk-C2
(unnamed): sheet U22/Vcc_PWR, sheet U22/PAR0, sheet U23/Vss_PWR, sheet U23/PAR0
(unnamed): sheet U22/0Rx+C2, sheet U23/0Rx+C1, sheet U24/ITx+
(unnamed): sheet U22/0Rx-C2, sheet U23/0Rx-C1, sheet U24/ITx-
(unnamed): sheet U22/0Tx+, sheet U23/IRx+C1, sheet U24/IRx+C2
(unnamed): sheet U22/0Tx-, sheet U23/IRx-C1, sheet U24/IRx-C2
(unnamed): sheet U22/0CK+, sheet U23/ICk+C1, sheet U24/ICk+C2
(unnamed): sheet U22/0CK-, sheet U23/ICk-C1, sheet U24/ICk-C2
(unnamed): sheet U23/Vcc_PWR, sheet U23/PAR1, sheet U24/Vss_PWR
(unnamed): sheet U23/0Rx+C2, sheet U24/0Rx+C1, sheet U25/ITx+
(unnamed): sheet U23/0Rx-C2, sheet U24/0Rx-C1, sheet U25/ITx-
(unnamed): sheet U23/0Tx+, sheet U24/IRx+C1, sheet U25/IRx+C2
(unnamed): sheet U23/0Tx-, sheet U24/IRx-C1, sheet U25/IRx-C2
(unnamed): sheet U23/0CK+, sheet U24/ICk+C1, sheet U25/ICk+C2
(unnamed): sheet U23/0CK-, sheet U24/ICk-C1, sheet U25/ICk-C2
(unnamed): sheet U24/Vcc_PWR, sheet U24/PAR0, sheet U24/PAR1, sheet U27/Vss_PWR
(unnamed): sheet U24/0Rx+C2, sheet U25/0Rx+C1, sheet U26/ITx+
(unnamed): sheet U24/0Rx-C2, sheet U25/0Rx-C1, sheet U26/ITx-
(unnamed): sheet U24/0Tx+, sheet U25/IRx+C1, sheet U26/IRx+C2
(unnamed): sheet U24/0Tx-, sheet U25/IRx-C1, sheet U26/IRx-C2
(unnamed): sheet U24/0CK+, sheet U25/ICk+C1, sheet U26/ICk+C2
(unnamed): sheet U24/0CK-, sheet U25/ICk-C1, sheet U26/ICk-C2
(unnamed): sheet U25/Vcc_PWR, sheet U25/PAR0, sheet U26/Vss_PWR, sheet U26/PAR0
(unnamed): sheet U25/0Rx+C2, sheet U26/0Rx+C1, sheet U27/ITx+
(unnamed): sheet U25/0Rx-C2, sheet U26/0Rx-C1, sheet U27/ITx-
(unnamed): sheet U25/0Tx+, sheet U26/IRx+C1, sheet U27/IRx+C2
(unnamed): sheet U25/0Tx-, sheet U26/IRx-C1, sheet U27/IRx-C2
(unnamed): sheet U25/0CK+, sheet U26/ICk+C1, sheet U27/ICk+C2
(unnamed): sheet U25/0CK-, sheet U26/ICk-C1, sheet U27/ICk-C2
(unnamed): sheet U26/0Rx+C2, sheet U27/0Rx+C1, sheet U28/ITx+
(unnamed): sheet U26/0Rx-C2, sheet U27/0Rx-C1, sheet U28/ITx-
(unnamed): sheet U26/0Tx+, sheet U27/IRx+C1, sheet U28/IRx+C2
(unnamed): sheet U26/0Tx-, sheet U27/IRx-C1, sheet U28/IRx-C2
(unnamed): sheet U26/0CK+, sheet U27/ICk+C1, sheet U28/ICk+C2
(unnamed): sheet U26/0CK-, sheet U27/ICk-C1, sheet U28/ICk-C2
(unnamed): sheet U27/0Rx+C2, sheet U28/0Rx+C1
(unnamed): sheet U27/0Rx-C2, sheet U28/0Rx-C1
(unnamed): sheet U27/0Tx+, sheet U28/IRx+C1
(unnamed): sheet U27/0Tx-, sheet U28/IRx-C1
(unnamed): sheet U27/0CK+, sheet U28/ICk+C1
(unnamed): sheet U27/0CK-, sheet U28/ICk-C1

## Notes on the sheet
- 1
- 2
- 6
- 3
- 4
- 5
- 7
- 8
- 9
- 10
- 11
- 12
- 13
- 14
- 15
- 16
- 17
- 18
- 19
- 20
- 21
- 22
- 23
- 24
- 25
- 26
- 27
- 28
- Halil TEPEDELEN